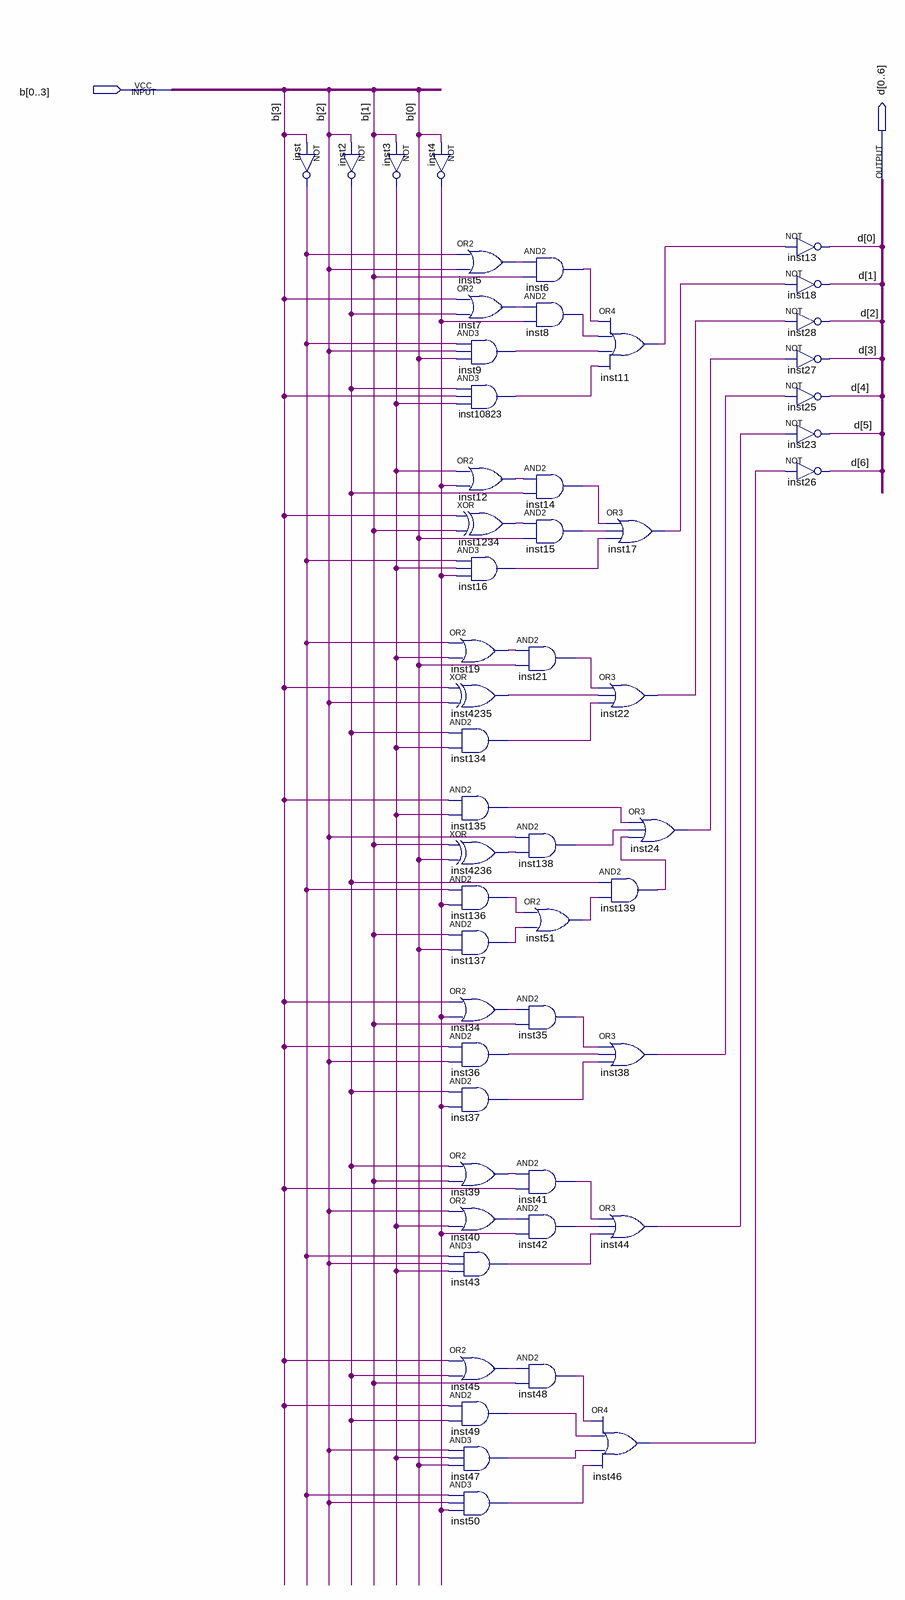
[diagram p0: schematic sheet]
// Quartus schematic 4bits_to_7seg_low.bdf as structural Verilog: 54 symbols, 2 pins
module \4bits_to_7seg_low  (
  input  [0:3] b,
  output [0:6] d
);

  wire inst2_out, inst3_out, inst4_out, inst5_out, inst6_out, inst7_out, inst8_out, inst9_out, inst11_out,
       inst12_out, inst14_out, inst15_out, inst16_out, inst17_out, inst19_out, inst21_out, inst22_out,
       inst24_out, inst34_out, inst35_out, inst36_out, inst37_out, inst38_out, inst39_out, inst40_out,
       inst41_out, inst42_out, inst43_out, inst44_out, inst45_out, inst46_out, inst47_out, inst48_out,
       inst49_out, inst50_out, inst51_out, inst134_out, inst135_out, inst136_out, inst137_out, inst138_out,
       inst139_out, inst1234_out, inst4235_out, inst4236_out, inst10823_out, inst_out;

  not inst (inst_out, b[3]);
  not inst2 (inst2_out, b[2]);
  not inst3 (inst3_out, b[1]);
  not inst4 (inst4_out, b[0]);
  or inst5 (inst5_out, inst_out, b[2]);
  or inst7 (inst7_out, b[3], inst2_out);
  and inst9 (inst9_out, inst_out, b[2], b[0]);
  and inst10823 (inst10823_out, inst2_out, b[3], inst3_out);
  or inst12 (inst12_out, inst3_out, inst4_out);
  xor inst1234 (inst1234_out, b[3], b[1]);
  and inst16 (inst16_out, inst_out, inst3_out, inst4_out);
  or inst19 (inst19_out, inst_out, inst3_out);
  xor inst4235 (inst4235_out, b[3], b[2]);
  and inst134 (inst134_out, inst2_out, inst3_out);
  and inst135 (inst135_out, b[3], inst3_out);
  xor inst4236 (inst4236_out, b[1], b[0]);
  and inst136 (inst136_out, inst_out, inst4_out);
  and inst137 (inst137_out, b[1], b[0]);
  or inst34 (inst34_out, b[3], inst4_out);
  and inst36 (inst36_out, b[3], b[2]);
  and inst37 (inst37_out, inst2_out, inst4_out);
  or inst39 (inst39_out, inst2_out, b[1]);
  or inst40 (inst40_out, b[2], inst3_out);
  and inst43 (inst43_out, inst_out, b[2], inst3_out);
  or inst45 (inst45_out, b[3], inst2_out);
  and inst49 (inst49_out, b[3], inst2_out);
  and inst47 (inst47_out, b[2], inst3_out, b[0]);
  and inst50 (inst50_out, inst_out, b[2], inst4_out);
  and inst6 (inst6_out, inst5_out, b[1]);
  and inst8 (inst8_out, inst7_out, inst4_out);
  and inst14 (inst14_out, inst12_out, inst2_out);
  and inst15 (inst15_out, inst1234_out, b[0]);
  and inst21 (inst21_out, inst19_out, b[0]);
  and inst138 (inst138_out, b[2], inst4236_out);
  or inst51 (inst51_out, inst136_out, inst137_out);
  and inst35 (inst35_out, inst34_out, b[1]);
  and inst41 (inst41_out, inst39_out, b[3]);
  and inst42 (inst42_out, inst40_out, inst4_out);
  and inst48 (inst48_out, inst45_out, b[1]);
  or inst11 (inst11_out, inst6_out, inst8_out, inst9_out, inst10823_out);
  or inst22 (inst22_out, inst21_out, inst4235_out, inst134_out);
  and inst139 (inst139_out, inst2_out, inst51_out);
  or inst38 (inst38_out, inst35_out, inst36_out, inst37_out);
  or inst44 (inst44_out, inst41_out, inst42_out, inst43_out);
  or inst46 (inst46_out, inst48_out, inst49_out, inst47_out, inst50_out);
  or inst17 (inst17_out, inst14_out, inst15_out, inst16_out);
  or inst24 (inst24_out, inst135_out, inst138_out, inst139_out);
  not inst13 (d[0], inst11_out);
  not inst18 (d[1], inst17_out);
  not inst28 (d[2], inst22_out);
  not inst27 (d[3], inst24_out);
  not inst25 (d[4], inst38_out);
  not inst23 (d[5], inst44_out);
  not inst26 (d[6], inst46_out);
endmodule
